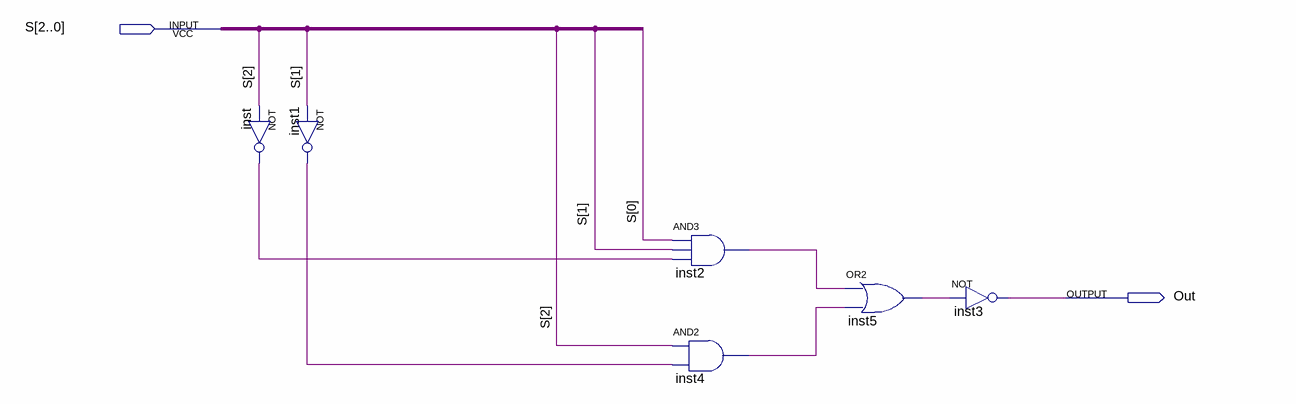
[diagram p0: schematic sheet]
// Quartus schematic compartor_detector.bdf as structural Verilog: 6 symbols, 2 pins
module compartor_detector (
  input  [2:0] S,
  output Out
);

  wire inst1_out, inst2_out, inst4_out, inst5_out, inst_out;

  not inst (inst_out, S[2]);
  not inst1 (inst1_out, S[1]);
  and inst2 (inst2_out, S[0], S[1], inst_out);
  and inst4 (inst4_out, S[2], inst1_out);
  or inst5 (inst5_out, inst2_out, inst4_out);
  not inst3 (Out, inst5_out);
endmodule
